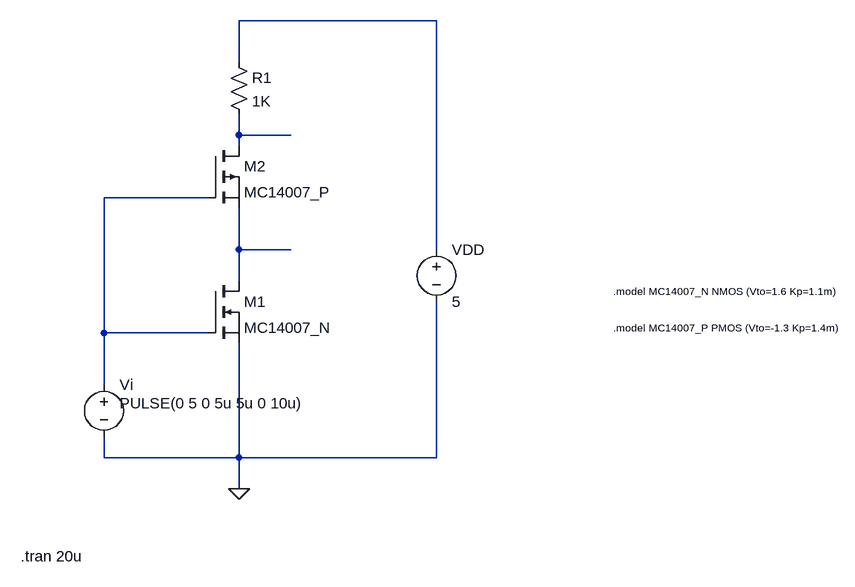
[diagram p0: schematic 1.3.3.asc]
1.3.3.asc, the LTspice schematic file:
Version 4
SHEET 1 880 680
WIRE -128 -432 -432 -432
WIRE -432 -368 -432 -432
WIRE -432 -256 -432 -288
WIRE -352 -256 -432 -256
WIRE -432 -240 -432 -256
WIRE -480 -160 -640 -160
WIRE -432 -80 -432 -144
WIRE -352 -80 -432 -80
WIRE -128 -80 -128 -432
WIRE -432 -32 -432 -80
WIRE -640 48 -640 -160
WIRE -480 48 -640 48
WIRE -640 128 -640 48
WIRE -640 240 -640 208
WIRE -432 240 -432 64
WIRE -432 240 -640 240
WIRE -128 240 -128 0
WIRE -128 240 -432 240
WIRE -432 288 -432 240
FLAG -432 288 0
SYMBOL nmos -480 -32 R0
SYMATTR InstName M1
SYMATTR Value MC14007_N
SYMBOL voltage -128 -96 R0
SYMATTR InstName VDD
SYMATTR Value 5
SYMBOL voltage -640 112 R0
WINDOW 3 24 44 Left 2
WINDOW 123 0 0 Left 0
WINDOW 39 0 0 Left 0
SYMATTR Value PULSE(0 5 0 5u 5u 0 10u)
SYMATTR InstName Vi
SYMBOL pmos -480 -240 R0
SYMATTR InstName M2
SYMATTR Value MC14007_P
SYMBOL res -448 -384 R0
SYMATTR InstName R1
SYMATTR Value 1K
TEXT 144 -16 Left 1 !.model MC14007_N NMOS (Vto=1.6 Kp=1.1m)
TEXT 144 40 Left 1 !.model MC14007_P PMOS (Vto=-1.3 Kp=1.4m)
TEXT -768 392 Left 2 !.tran 20u

The netlist it stands for:
* 1.3.3.asc
M1 N004 N003 0 0 MC14007_N
VDD N001 0 5
Vi N003 0 PULSE(0 5 0 5u 5u 0 10u)
M2 N002 N003 N004 N004 MC14007_P
R1 N001 N002 1K
.model NMOS NMOS
.model PMOS PMOS
.lib standard.mos
.model MC14007_N NMOS (Vto=1.6 Kp=1.1m)
.model MC14007_P PMOS (Vto=-1.3 Kp=1.4m)
.tran 20u
.backanno
.end